# Altium project Power Regulators.PrjPcb
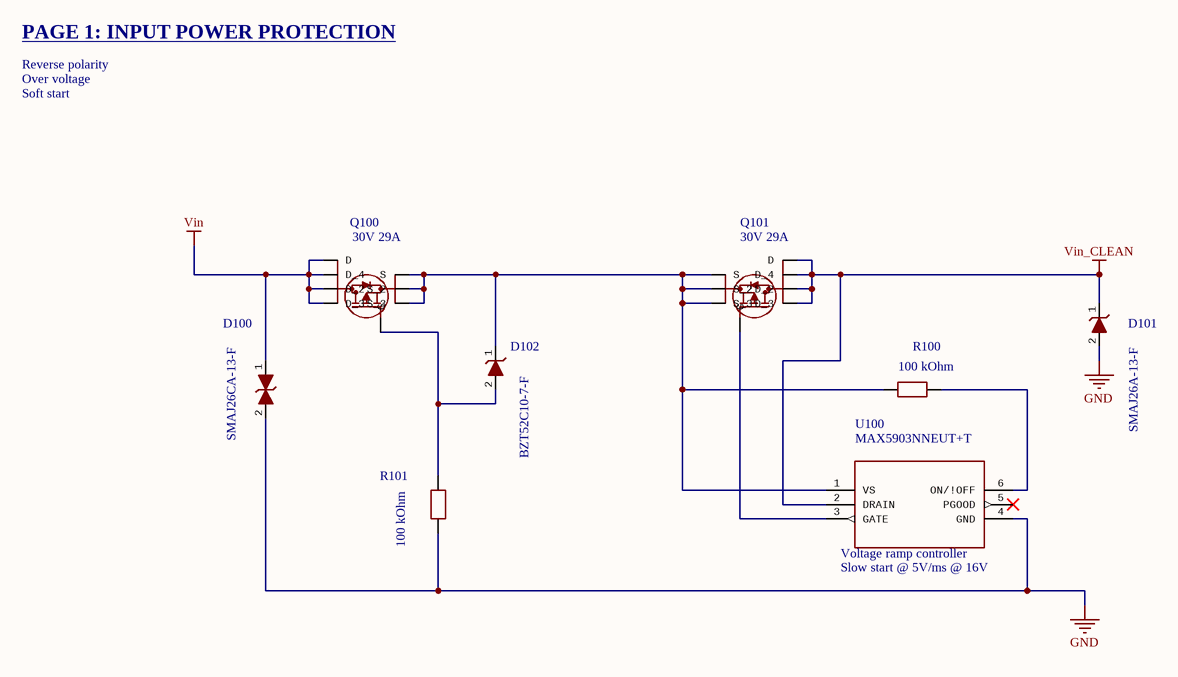
[diagram p0: 1_InputPowerProtection.SchDoc]
7 sheets, 106 parts. Net scope: flat (ports and power ports of the same name join across sheets).
Sheets:
  1_InputPowerProtection.SchDoc
  2_5VSwithcingRegulator.SchDoc
  3_3V3LDO.SchDoc
  4_5VLDO.SchDoc
  5_AnalogSense.SchDoc
  6_Auxilaries.SchDoc
  7_Peripherals.SchDoc

## Sheet 1_InputPowerProtection.SchDoc
size A4; PageSetup: Record=PageOptions|CenterHorizontal=True|CenterVertical=True|PrintScale=1.00|XCorrection=1.00|YCorrection=1.00|PrintKind=1|BorderSize=5000000|LeftOffset=0|BottomOffset=0|Orientation=2|PaperLength=1000|PaperWidth=1000|Scale=100|PaperSource=7|PrintQuality=-3|MediaType=1|DitherType=10|PrintScaleMode=1|PaperKind=Executive|PaperIndex=7

### Parts
D100  SMAJ26CA-13-F  [DIODE_DO-214AC]
D101  SMAJ26A-13-F  [DIODE_DO-214AC]
D102  BZT52C10-7-F  [DIODE_SOD-123]
Q100  value 30V 29A  [MOSFET_SOIC-8]  (hidden comment: SI4459ADY)
Q101  value 30V 29A  [MOSFET_SOIC-8]  (hidden comment: SI4459ADY)
R100  value 100 kOhm  [RES_0603]  (hidden comment: ERJ3GEYJ104V)
R101  value 100 kOhm  [RES_0603]  (hidden comment: ERJ3GEYJ104V)
U100  MAX5903NNEUT+T  [HOTSWAP_SOT-6]

### Nets
GND: D100.2 D101.2 R101.1 U100.4(GND)
Vin: D100.1 Q100.5(D_3) Q100.6(D_2) Q100.7(D_4) Q100.8(D)
Vin_CLEAN: D101.1 Q101.5(D_3) Q101.6(D_2) Q101.7(D_4) Q101.8(D) U100.2(DRAIN)
NetD102_1: D102.1 Q100.1(S_3) Q100.2(S_2) Q100.3(S) Q101.1(S_3) Q101.2(S_2) Q101.3(S) R100.1 U100.1(VS)
NetD102_2: D102.2 Q100.4(G) R101.2
NetQ101_4: Q101.4(G) U100.3(GATE)
NetR100_2: R100.2 U100.6(ON/!OFF)

Not connected (* = marked no-connect by the designer): U100 5(PGOOD)*

### Notes on the sheet
- PAGE 1: INPUT POWER PROTECTION
- Reverse polarity
- Over voltage
- Soft start
- (near U100) Voltage ramp controller
- (near U100) Slow start @ 5V/ms @ 16V

### Library data of the parts
D100 = SMAJ26CA-13-F: Diode TVS Bidirectional 26V; Mfr_Name: Diodes Inc; Manufacturer_Part_Number: SMAJ26A-13-F; Value: 26V; Link: https://www.digikey.ca/en/products/detail/diodes-incorporated/SMAJ26A-13-F/806555?s=N4IgTCBcDaIMoFkCCApMA2JBaAYgEQEkAVAJSwDk8QBdAXyA; Package: DO-214AC; PartNumber: SMAJ26CA-13-F; SupplierPartNumber: SMAJ26CA-FDITR-ND; SuppliersPartNumber: C134976
D101 = SMAJ26A-13-F: Diode TVS 26V; Mfr_Name: Diodes Inc; GateName_1: A; DeviceName: SMA_DIO; SymbolName_1: DIODE; LibraryName: 2022-09-06_21-11-13_Library; DeviceSetName: SMAJ26A-13-F; Copyright: Copyright (C) 2022 Ultra Librarian. All rights reserved.; Manufacturer_Part_Number: SMAJ26A-13-F; Digi-Key_Part_Number_1: SMAJ26A-FDICT-ND; Digi-Key_Part_Number_2: SMAJ26A-FDIDKR-ND; Digi-Key_Part_Number_3: SMAJ26A-FDITR-ND; Link: https://www.digikey.ca/en/products/detail/diodes-incorporated/SMAJ26A-13-F/806555?s=N4IgTCBcDaIMoFkCCApMA2JBaAjAZiwDEQBdAXyA; Package: DO-214AC; PartNumber: SMAJ26A-13-F; SupplierPartNumber: SMAJ26A-FDITR-ND; SuppliersPartNumber: C134975
D102 = BZT52C10-7-F: Diode Zener 10V 370mW; Manufacturer_Name: Diodes Inc.; SymbolName_1: BZT52C10-7-F; LibraryName: BZT52C10-7-F; DeviceSetName: BZT52C10-7-F; Manufacturer_Part_Number: BZT52C10-7-F; Mouser_Part_Number: 621-BZT52C10-F; Mouser_Price-Stock: https://www.mouser.co.uk/ProductDetail/Diodes-Incorporated/BZT52C10-7-F?qs=%2F0USrAtie8G0fxvqWmtHrQ%3D%3D; Link: https://www.digikey.ca/en/products/detail/diodes-incorporated/BZT52C10-7-F/717726; Value: 10V 370mW; Package: SOD-123; PartNumber: BZT52C10-7-F; SupplierPartNumber: BZT52C10-FDITR-ND; SuppliersPartNumber: C155227
Q100 Q101 = SI4459ADY-T1-GE3SO_ADY-T1-GE3_VIS-M: P-Channel 30V 29A 5mOHm; Mfr_Name: Vishay; Manufacturer_Part_Number: SI4459ADY-T1-GE3; Link: https://www.digikey.ca/en/products/detail/vishay-siliconix/SI4459ADY-T1-GE3/1978849?s=N4IgTCBcDaIMoEkAsSCsBOAggEQJoFoAVARnwHEBRAZhAF0BfIA; Package: SOIC-8; PartNumber: SI4459ADY-T1-GE3; SupplierNumber: SI4459ADY-T1-GE3TR-ND; SuppliersPartNumber: C143743
R100 R101 = ERJ3GEYJ104V: Res 100kOhm 1/10W 0603; Manufacturer_Name: Panasonic; Link: https://www.digikey.ca/en/products/detail/panasonic-electronic-components/ERJ-3GEYJ104V/135832?s=N4IgTCBcDaIKICUBSBmA4nAmkgjABgBYA1EAXQF8g; Package: 0603; SupplierPartNumber: P100KGTR-ND; SuppliersPartNumber: C278633; PartNumber: ERJ3GEYJ104V
U100 = MAX5903NNEUT+T: Hot Swap Controller MAX5903NNEUT+T; Manufacturer: Analog Devices Inc; DeviceName: 21-0058_U6F+6_MXM-M; DeviceSetName: MAX5903NNEUT+T; Copyright: Copyright (C) 2023 Ultra Librarian. All rights reserved.; PartNumber: MAX5903NNEUT+T; Digi-Key_Part_Number_1: MAX5903NNEUT+T-ND; Digi-Key_Part_Number_2: MAX5903NNEUT+TCT-ND; Digi-Key_Part_Number_3: MAX5903NNEUT+TDKR-ND; Link: https://www.digikey.ca/en/products/detail/analog-devices-inc-maxim-integrated/MAX5903NNEUT-T/1781318?s=N4IgTCBcDaILIEEAaBWAnABgMwDkcFEBVAFQGpiQBdAXyA; SupplierNumber: MAX5903NNEUT+TTR-ND; SuppliersPartNumber: *; Value: *; Package: SOT-23-6

## Sheet 2_5VSwithcingRegulator.SchDoc
size A4; PageSetup: Record=PageOptions|CenterHorizontal=True|CenterVertical=True|PrintScale=1.00|XCorrection=1.00|YCorrection=1.00|PrintKind=1|BorderSize=5000000|LeftOffset=0|BottomOffset=0|Orientation=2|PaperLength=1000|PaperWidth=1000|Scale=100|PaperSource=7|PrintQuality=-3|MediaType=1|DitherType=10|PrintScaleMode=1|PaperKind=Executive|PaperIndex=7
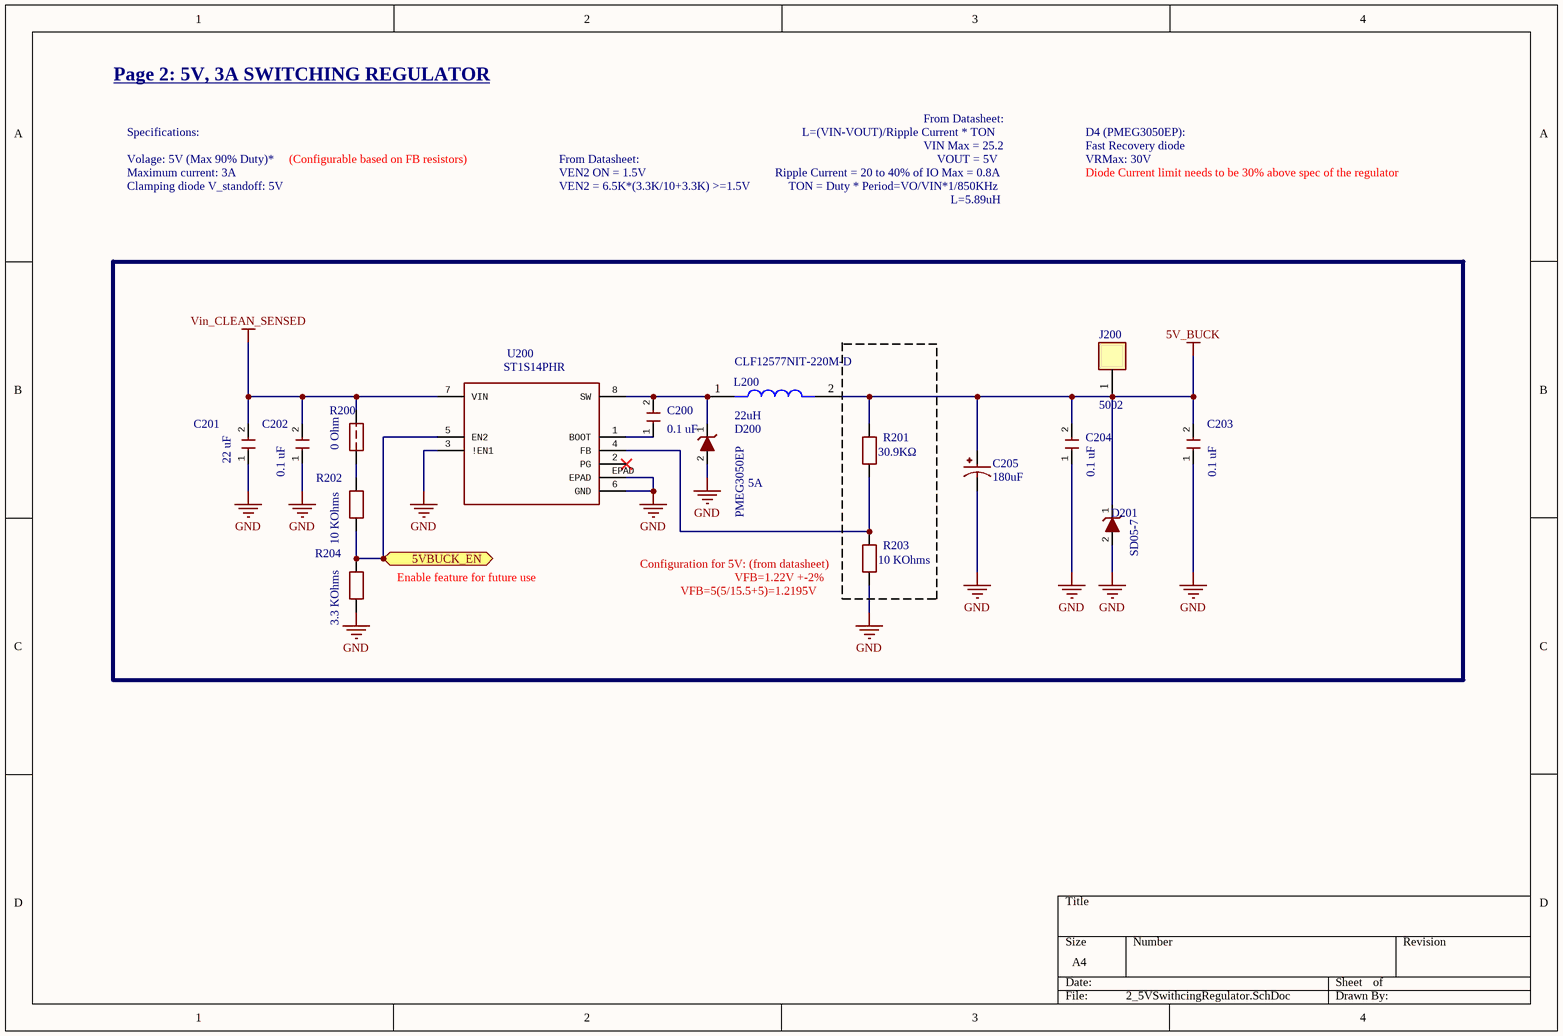
[diagram p1: 2_5VSwithcingRegulator.SchDoc]

### Parts
C200  value 0.1 uF  [CAP_0603]  (hidden comment: CL10B104KB8NNNC)
C201  value 22 uF  [CAP_0603]  (hidden comment: GRM188R61A226ME15D)
C202  value 0.1 uF  [CAP_0603]  (hidden comment: CL10B104KB8NNNC)
C203  value 0.1 uF  [CAP_0603]  (hidden comment: CL10B104KB8NNNC)
C204  value 0.1 uF  [CAP_0603]  (hidden comment: CL10B104KB8NNNC)
C205  value 180uF  [CAP_EEEFKE181XSP]  (hidden comment: EEE-FKE181XSP)
D200  PMEG3050EP  [DIODE_SOD-128]
D201  SD05-7  [DIODE_DO-214AC]
J200  5002  [KEYSTONE_5002]
L200  CLF12577NIT-220M-D  value 22uH  [IND_TDK_CLF12577NIT]
R200  value 0 Ohm  [RES_0603]  (hidden comment: ERJ3GEY0R00V)
R201  value 30.9KΩ  [RES_0603]  (hidden comment: CRCW060330K9FKEA)
R202  value 10 KOhms  [RES_0603]  (hidden comment: ERJ3GEYJ103V)
R203  value 10 KOhms  [RES_0603]  (hidden comment: ERJ3GEYJ103V)
R204  value 3.3 KOhms  [RES_0603]  (hidden comment: P3.3KGDKR-ND)
U200  ST1S14PHR  [REG_SOP8_SOIC8_EPAD]

### Ports
5VBUCK_EN (in)

### Nets
5V_BUCK: C203.2 C204.2 C205.1 D201.1 J200.1 L200.2 R201.2
GND: C201.1 C202.1 C203.1 C204.1 C205.2 D200.2 D201.2 R203.1 R204.1 U200.3(!EN1) U200.6(GND) U200.EPAD
Vin_CLEAN_SENSED: C201.2 C202.2 R200.2 U200.7(VIN)
5VBUCK_EN: R202.1 R204.2 U200.5(EN2) ; port 5VBUCK_EN
NetC200_1: C200.1 U200.1(BOOT)
NetC200_2: C200.2 D200.1 L200.1 U200.8(SW)
NetR200_1: R200.1 R202.2
NetR201_1: R201.1 R203.2 U200.4(FB)

Not connected (* = marked no-connect by the designer): U200 2(PG)*

### Notes on the sheet
- Page 2: 5V, 3A SWITCHING REGULATOR
- Volage: 5V (Max 90% Duty)*
- Maximum current: 3A
- Specifications:
- (Configurable based on FB resistors)
- From Datasheet:
- VEN2 ON = 1.5V
- Ripple Current = 20 to 40% of IO Max = 0.8A
- L=(VIN-VOUT)/Ripple Current * TON
- VIN Max = 25.2
- VOUT = 5V
- Fast Recovery diode
- VRMax: 30V
- D4 (PMEG3050EP):
- Diode Current limit needs to be 30% above spec of the regulator
- Clamping diode V_standoff: 5V
- VEN2 = 6.5K*(3.3K/10+3.3K) >=1.5V
- TON = Duty * Period=VO/VIN*1/850KHz
- L=5.89uH
- (near D200) 5A
- (near R204) Enable feature for future use
- (near R203) Configuration for 5V: (from datasheet)
- (near R203) VFB=1.22V +-2%
- (near R203) VFB=5(5/15.5+5)=1.2195V

### Library data of the parts
C200 C202-C204 = CL10B104KB8NNNC: Cap Ceramic 0.1uF 50V 0603; Manufacturer_Name: Samsung; Link: https://www.digikey.ca/en/products/detail/samsung-electro-mechanics/CL10B104KB8NNNC/3886658?s=N4IgTCBcDaIMIBkCMAGAQqgLAaTQDgDki4QBdAXyA; Package: 0603; PartNumber: CL10B104KB8NNNC; SupplierPartNumber: 1276-1000-2-ND; SuppliersPartNumber: C1591
C201 = GRM188R61A226ME15D: Cap Ceramic 22uF 10V 0603; Manufacturer_Name: Samsung Electro-Mechanics; Link: https://www.digikey.ca/en/products/detail/murata-electronics/GRM188R61A226ME15D/5027561?s=N4IgTCBcDaIOICUCyBGAHGhA2FBBMYWSAoigKwAiIAugL5A; Package: 0603; PartNumber: GRM188R61A226ME15D; SupplierNumber: 490-10476-2-ND; SuppliersPartNumber: C84419
C205 = EEEFKE181XSP: Cap Electrolytic 180uF SMD,D6.3xL7.7mm; Manufacturer: Panasonic; Package: SMD,D6.3xL7.7mm; PartNumber: EEE-FKE181XSP; SupplierNumber: P18956TR-ND; SuppliersPartNumber: C413657; Link: https://www.digikey.ca/en/products/detail/panasonic-electronic-components/EEE-FKE181XSP/5805038?s=N4IgTCBcDaIKIIGIGk4EYAcaAaBlACiALoC%2BQA
D200 = PMEG3050EP: Diode FastRecovery 30V SOD-128; Mfr_Name: Nexperia; Value: FastRecovery 30V; Link: https://www.digikey.ca/en/products/detail/nexperia-usa-inc/PMEG3050EP-115/2228695; Package: SOD-128; PartNumber: PMEG3050EP; SupplierPartNumber: 1727-5317-2-ND; SuppliersPartNumber: C134975
D201 = SD05-7: Diode TVS 5V; Mfr_Name: Diodes Inc; Value: TVS 5V; Link: https://www.digikey.ca/en/products/detail/diodes-incorporated/SD05-7/2052792; Package: SOD-323; PartNumber: SD05-7; SupplierPartNumber: SD05DITR-ND; SuppliersPartNumber: C460454
J200 = 5002: Test Point Ring Keystone; Manufacturer: Keystone Electronics; Value: Test Point Keystone Electronics; Package: *; PartNumber: 5002; SupplierNumber: 36-5002-ND; SuppliersPartNumber: C238123; Link: https://www.digikey.ca/en/products/detail/keystone-electronics/5002/255328
L200 = CLF12577NIT-220M-D: Ind 22uH Shielded Drum Core 4.5A; Manufacturer: TDK; PartNumber: CLF12577NIT-220M-D; Package: NON STANDARD-2 TDK; Link: https://www.digikey.ca/en/products/detail/tdk-corporation/CLF12577NIT-220M-D/6236873?s=N4IgTCBcDaIMIBkBiBGMBWA7JgcgSQBUBaMMABgFkiAREAXQF8g; SupplierPartNumber: 445-174735-2-ND; SuppliersPartNumber: C138319
R200 = ERJ3GEY0R00V: Res 0Ohm 1/10W 0603; Link: https://www.digikey.ca/en/products/detail/panasonic-electronic-components/ERJ-3GEY0R00V/135656?s=N4IgTCBcDaIKICUBSBmA4nAmgBgd7AaiALoC%2BQA; Package: 0603; SupplierPartNumber: P0.0GTR-ND; SuppliersPartNumber: C122704; PartNumber: ERJ3GEY0R00V
R201 = CRCW060330K9FKEA: Res 30.9KOhm 1/10W 0603; Manufacturer_Name: Vishay Intertech; Link: https://www.digikey.ca/en/products/detail/vishay-dale/CRCW060330K9FKEAHP/2222269; Package: 0603; SupplierPartNumber: 541-30.9KSTR-ND; SuppliersPartNumber: C844354; PartNumber: CRCW060330K9FKEA
R202 R203 = ERJ3GEYJ103V: Res 10KOhms 1/10W 0603; Link: https://www.mouser.ca/ProductDetail/Panasonic/ERJ-3GEYJ103V?qs=66DK8nO8gJBWgc%252B0VNNxzg%3D%3D; Package: 0603; PartNumber: ERJ3GEYJ103V; SupplierPartNumber: 667-ERJ-3GEYJ103V; SuppliersPartNumber: C169849
R204 = P3.3KGDKR-ND: Res 3.3KOhms 1/10W 0603; PartNumber: ERJ-3GEYJ332V; SymbolName_1: RES; Link: https://www.digikey.ca/en/products/detail/panasonic-electronic-components/ERJ-3GEYJ332V/135886?s=N4IgTCBcDaIKICUBSBaAzAcTgTSWtYAaiALoC%2BQA; Package: 0603; SupplierNumber: P3.3KGDKR-ND; SuppliersPartNumber: C403480
U200 = ST1S14PHR: Switching Step-down In5.5V~48V Out3A; Mfr_Name: STMicroelectronics; DeviceSetName: ST1S14PHR; Manufacturer_Part_Number: ST1S14PHR; Value: Switching Step-down; Link: https://www.digikey.ca/en/products/detail/stmicroelectronics/ST1S14PHR/2469146?s=N4IgTCBcDaIMoBUCMckBYAKAJASiAugL5A; Package: HSOP-8; PartNumber: ST1S14PHR; SupplierPartNumber: 497-10816-2-ND; SuppliersPartNumber: C84130

## Sheet 3_3V3LDO.SchDoc
size A4; PageSetup: Record=PageOptions|CenterHorizontal=True|CenterVertical=True|PrintScale=1.00|XCorrection=1.00|YCorrection=1.00|PrintKind=1|BorderSize=5000000|LeftOffset=0|BottomOffset=0|Orientation=2|PaperLength=1000|PaperWidth=1000|Scale=100|PaperSource=7|PrintQuality=-3|MediaType=1|DitherType=10|PrintScaleMode=1|PaperKind=Executive|PaperIndex=7
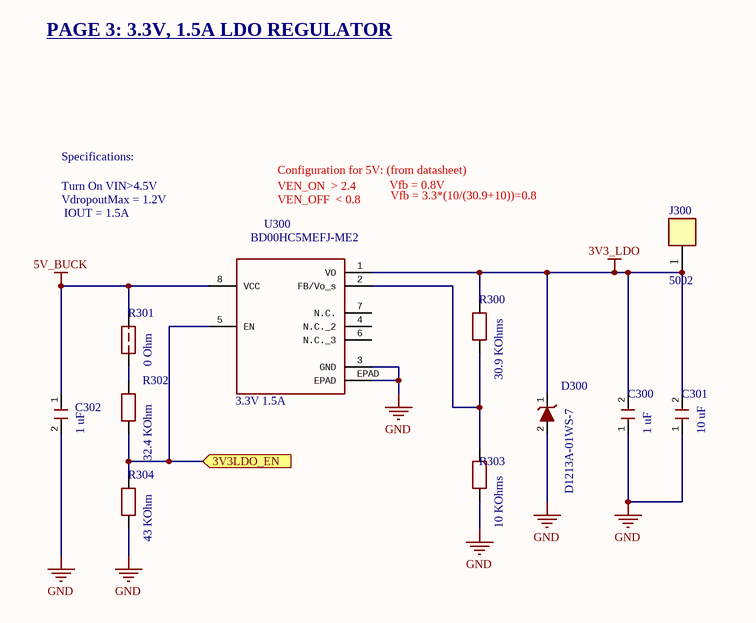
[diagram p2: 3_3V3LDO.SchDoc]

### Parts
C300  value 1 uF  [CAP_0603]  (hidden comment: GCM188R71C105KA64)
C301  value 10 uF  [CAP_0603]  (hidden comment: GRM188R61E106KA73D)
C302  value 1 uF  [CAP_0603]  (hidden comment: GRT188R61H105KE13D)
D300  D1213A-01WS-7  [DIODE_DO-214AC]
J300  5002  [KEYSTONE_5002]
R300  value 30.9 KOhms  [RES_0603]  (hidden comment: ERJ6ENF3092V)
R301  value 0 Ohm  [RES_0603]  (hidden comment: ERJ3GEY0R00V)
R302  value 32.4 KOhm  [RES_0603]  (hidden comment: RC0603FR-0732K4L)
R303  value 10 KOhms  [RES_0603]  (hidden comment: ERJ3GEYJ103V)
R304  value 43 KOhm  [RES_0603]  (hidden comment: ERJ3GEYJ433V)
U300  BD00HC5MEFJ-ME2  value 3.3V 1.5A  [REG_SOP8_SOIC8_EPAD]

### Ports
3V3LDO_EN (in)

### Nets
3V3_LDO: C300.2 C301.2 D300.1 J300.1 R300.2 U300.1(VO)
5V_BUCK: C302.1 R301.2 U300.8(VCC)
GND: C300.1 C301.1 C302.2 D300.2 R303.1 R304.1 U300.3(GND) U300.EPAD
3V3LDO_EN: R302.2 R304.2 U300.5(EN) ; port 3V3LDO_EN
NetR300_1: R300.1 R303.2 U300.2(FB/Vo_s)
NetR301_1: R301.1 R302.1

Not connected (* = marked no-connect by the designer): U300 4(N.C._2) 6(N.C._3) 7(N.C.)

### Notes on the sheet
- PAGE 3: 3.3V, 1.5A LDO REGULATOR
- Turn On VIN>4.5V
- Specifications:
- VEN_ON  > 2.4
- Configuration for 5V: (from datasheet)
- Vfb = 0.8V
- VdropoutMax = 1.2V
- IOUT = 1.5A
- VEN_OFF  < 0.8
- Vfb = 3.3*(10/(30.9+10))=0.8

### Library data of the parts
C300 = GCM188R71C105KA64D: Cap Ceramic 1uF 16V 0603; Manufacturer_Name: Murata Electronics; GateName_1: G$1; SymbolName_1: GCM188R71C105KA64D; LibraryName: GCM188R71C105KA64D; DeviceSetName: GCM188R71C105KA64D; Manufacturer_Part_Number: GCM188R71C105KA64D; Mouser_Part_Number: 81-GCM188R71C105K64D; Mouser_Price-Stock: https://www.mouser.co.uk/ProductDetail/Murata-Electronics/GCM188R71C105KA64D?qs=bQrJpfqjX%252BKtVgLYIBGvIg%3D%3D; Arrow_Part_Number: GCM188R71C105KA64D; Arrow_Price-Stock: https://www.arrow.com/en/products/gcm188r71c105ka64d/murata-manufacturing?region=nac; Height: 0.9mm; Link: https://www.digikey.ca/en/products/detail/murata-electronics/GCM188R71C105KA64D/1979250; Package: 0603; PartNumber: GCM188R71C105KA64; SupplierPartNumber: 490-5241-2-ND; SuppliersPartNumber: C161212
C301 = GRM188R61E106KA73D: Cap Ceramic 10uF 35V 0603; Manufacturer_Name: Murata Electronics; Link: https://www.digikey.ca/en/products/detail/murata-electronics/GRM188R61E106KA73D/9867922?s=N4IgTCBcDaIOICUCyBGAHGhA2FBRFADFgNICCA7AMwAiIAugL5A; Package: 0603; PartNumber: GRM188R61E106KA73D; SupplierPartNumber: 490-18214-2-ND; SuppliersPartNumber: C344022
C302 = GRT188R61H105KE13D: Cap Ceramic 1uF 50V 0603; Manufacturer: Murata Electronics; PartNumber: GCM188R71C105KA64; Link: https://www.digikey.ca/en/products/detail/murata-electronics/GRT188R61H105KE13D/5416752?s=N4IgTCBcDaIOICUAqBGAHGhA2FAJFADAKwDSAoigMwAiIAugL5A; Package: 0603; SupplierPartNumber: 490-12330-2-ND; SuppliersPartNumber: C126631
D300 = D1213A-01WS-7: Diode TVS 3V3; Manufacturer: Diodes Inc; Value: TVS 3V3; Link: https://www.digikey.ca/en/products/detail/diodes-incorporated/D1213A-01WS-7/3340446?s=N4IgTCBcDaICIEYwIMwEEC0AGBB1AyhgOwgC6AvkA; Package: SOD-323; PartNumber: D1213A-01WS-7; SupplierPartNumber: D1213A-01WS-7DITR-ND; SuppliersPartNumber: C170167
J300 = 5002: as J200 on sheet 2_5VSwithcingRegulator; Package: *; PartNumber: 5002; SupplierNumber: 36-5002-ND; SuppliersPartNumber: C238123; Link: https://www.digikey.ca/en/products/detail/keystone-electronics/5002/255328
R300 = ERJ6ENF3092V: Res 30.9KOhms 1/8W 0603; Link: https://www.digikey.ca/en/products/detail/panasonic-electronic-components/ERJ-6ENF3092V/111570?s=N4IgTCBcDaIKICUBSA2OA5AYgZgAwE4wA1EAXQF8g; Package: 0603; PartNumber: ERJ6ENF3092V; SupplierPartNumber: P30.9KCTR-ND; SuppliersPartNumber: C416839
R301 = ERJ3GEY0R00V: Res 0Ohm 1/10W 0603; Link: https://www.digikey.ca/en/products/detail/panasonic-electronic-components/ERJ-3GEY0R00V/135656?s=N4IgTCBcDaIKICUBSBmA4nAmgBgd7AaiALoC%2BQA; Package: 0603; SupplierPartNumber: P0.0GTR-ND; SuppliersPartNumber: C122704; PartNumber: ERJ3GEY0R00V
R302 = RC0603FR-0732K4L: Res 32.4KOhm 1/10W 0603; Link: https://www.digikey.ca/en/products/detail/RC0603FR-0732K4L/311-32.4KHRCT-ND/730102?curr=cad&utm_campaign=buynow&utm_medium=aggregator&utm_source=octopart; Package: 0603; PartNumber: RC0603FR-0732K4L; SupplierPartNumber: 311-32.4KHRCT-ND; SuppliersPartNumber: C309561
R303 = ERJ3GEYJ103V: Res 10KOhms 1/10W 0603; Link: https://www.mouser.ca/ProductDetail/Panasonic/ERJ-3GEYJ103V?qs=66DK8nO8gJBWgc%252B0VNNxzg%3D%3D; Package: 0603; PartNumber: ERJ3GEYJ103V; SupplierPartNumber: 667-ERJ-3GEYJ103V; SuppliersPartNumber: C169849
R304 = ERJ3GEYJ433V: Res 43KOhm 1/10W 0603; Manufacturer_Name: Panasonic; Height: 0.55mm; Link: https://www.digikey.ca/en/products/detail/panasonic-electronic-components/ERJ-3GEYJ433V/104624; Package: 0603; PartNumber: ERJ3GEYJ433V; SupplierPartNumber: P43KGTR-ND; SuppliersPartNumber: C403499
U300 = BD00HC5MEFJ-ME2: LDO 5Vin 3V3Out 1.5A; Manufacturer: ROHM Semiconductor; PartNumber: BD00HC5MEFJ-ME2; SupplierNumber: BD00HC5MEFJ-ME2TR-ND; Link: https://www.digikey.ca/en/products/detail/rohm-semiconductor/BD00HC5MEFJ-ME2/4625492?s=N4IgTCBcDaIEYBMAMSAWBjArAWwKYDMArAWjwgF0BfIA; Package: 8-SOIC; SuppliersPartNumber: *

## Sheet 4_5VLDO.SchDoc
size A4
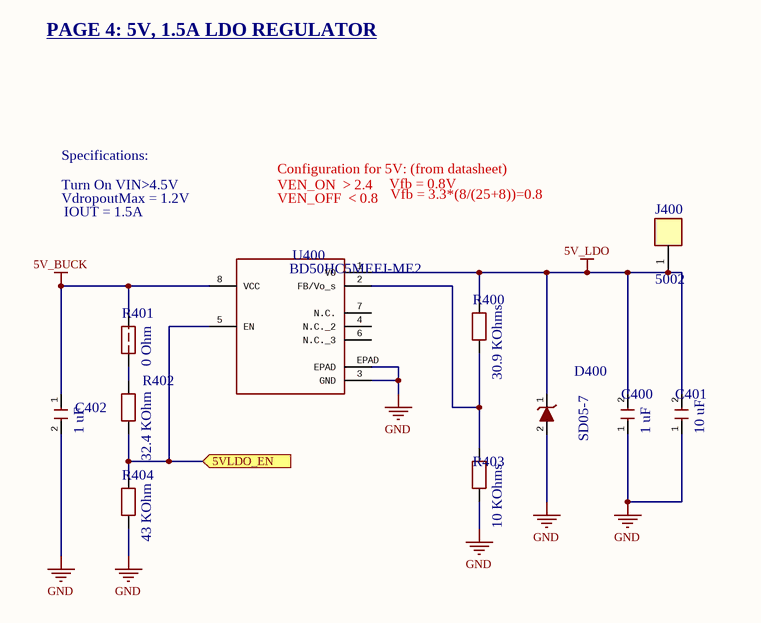
[diagram p3: 4_5VLDO.SchDoc]

### Parts
C400  value 1 uF  [CAP_0603]  (hidden comment: GCM188R71C105KA64)
C401  value 10 uF  [CAP_0603]  (hidden comment: GRM188R61E106KA73D)
C402  value 1 uF  [CAP_0603]  (hidden comment: GRT188R61H105KE13D)
D400  SD05-7  [DIODE_DO-214AC]
J400  5002  [KEYSTONE_5002]
R400  value 30.9 KOhms  [RES_0603]  (hidden comment: ERJ6ENF3092V)
R401  value 0 Ohm  [RES_0603]  (hidden comment: ERJ3GEY0R00V)
R402  value 32.4 KOhm  [RES_0603]  (hidden comment: RC0603FR-0732K4L)
R403  value 10 KOhms  [RES_0603]  (hidden comment: ERJ3GEYJ103V)
R404  value 43 KOhm  [RES_0603]  (hidden comment: ERJ3GEYJ433V)
U400  BD50HC5MEFJ-ME2  [REG_SOP8_SOIC8_EPAD]

### Ports
5VLDO_EN (in)

### Nets
5V_BUCK: C402.1 R401.2 U400.8(VCC)
5V_LDO: C400.2 C401.2 D400.1 J400.1 R400.2 U400.1(VO)
GND: C400.1 C401.1 C402.2 D400.2 R403.1 R404.1 U400.3(GND) U400.EPAD
5VLDO_EN: R402.2 R404.2 U400.5(EN) ; port 5VLDO_EN
NetR400_1: R400.1 R403.2 U400.2(FB/Vo_s)
NetR401_1: R401.1 R402.1

Not connected (* = marked no-connect by the designer): U400 4(N.C._2) 6(N.C._3) 7(N.C.)

### Notes on the sheet
- PAGE 4: 5V, 1.5A LDO REGULATOR
- Specifications:
- Configuration for 5V: (from datasheet)
- Turn On VIN>4.5V
- VdropoutMax = 1.2V
- IOUT = 1.5A
- VEN_ON  > 2.4
- VEN_OFF  < 0.8
- Vfb = 0.8V
- Vfb = 3.3*(8/(25+8))=0.8

### Library data of the parts
C400 = GCM188R71C105KA64D: as C300 on sheet 3_3V3LDO; SymbolName_1: GCM188R71C105KA64D; LibraryName: GCM188R71C105KA64D; DeviceSetName: GCM188R71C105KA64D; Manufacturer_Part_Number: GCM188R71C105KA64D; Mouser_Part_Number: 81-GCM188R71C105K64D; Mouser_Price-Stock: https://www.mouser.co.uk/ProductDetail/Murata-Electronics/GCM188R71C105KA64D?qs=bQrJpfqjX%252BKtVgLYIBGvIg%3D%3D; Arrow_Part_Number: GCM188R71C105KA64D; Arrow_Price-Stock: https://www.arrow.com/en/products/gcm188r71c105ka64d/murata-manufacturing?region=nac; Height: 0.9mm; Link: https://www.digikey.ca/en/products/detail/murata-electronics/GCM188R71C105KA64D/1979250; Package: 0603; PartNumber: GCM188R71C105KA64; SupplierPartNumber: 490-5241-2-ND; SuppliersPartNumber: C161212
C401 = GRM188R61E106KA73D: as C301 on sheet 3_3V3LDO; Link: https://www.digikey.ca/en/products/detail/murata-electronics/GRM188R61E106KA73D/9867922?s=N4IgTCBcDaIOICUCyBGAHGhA2FBRFADFgNICCA7AMwAiIAugL5A; Package: 0603; PartNumber: GRM188R61E106KA73D; SupplierPartNumber: 490-18214-2-ND; SuppliersPartNumber: C344022
C402 = GRT188R61H105KE13D: as C302 on sheet 3_3V3LDO; Link: https://www.digikey.ca/en/products/detail/murata-electronics/GRT188R61H105KE13D/5416752?s=N4IgTCBcDaIOICUAqBGAHGhA2FAJFADAKwDSAoigMwAiIAugL5A; Package: 0603; SupplierPartNumber: 490-12330-2-ND; SuppliersPartNumber: C126631
D400 = SD05-7: as D201 on sheet 2_5VSwithcingRegulator; Link: https://www.digikey.ca/en/products/detail/diodes-incorporated/SD05-7/2052792; Package: SOD-323; PartNumber: SD05-7; SupplierPartNumber: SD05DITR-ND; SuppliersPartNumber: C460454
J400 = 5002: as J200 on sheet 2_5VSwithcingRegulator; Package: *; PartNumber: 5002; SupplierNumber: 36-5002-ND; SuppliersPartNumber: C238123; Link: https://www.digikey.ca/en/products/detail/keystone-electronics/5002/255328
R400 = ERJ6ENF3092V: Res 30.9KOhms 1/8W 0603; Link: https://www.digikey.ca/en/products/detail/panasonic-electronic-components/ERJ-6ENF3092V/111570?s=N4IgTCBcDaIKICUBSA2OA5AYgZgAwE4wA1EAXQF8g; Package: 0603; PartNumber: ERJ6ENF3092V; SupplierPartNumber: P30.9KCTR-ND; SuppliersPartNumber: C416839
R401 = ERJ3GEY0R00V: Res 0Ohm 1/10W 0603; Link: https://www.digikey.ca/en/products/detail/panasonic-electronic-components/ERJ-3GEY0R00V/135656?s=N4IgTCBcDaIKICUBSBmA4nAmgBgd7AaiALoC%2BQA; Package: 0603; SupplierPartNumber: P0.0GTR-ND; SuppliersPartNumber: C122704; PartNumber: ERJ3GEY0R00V
R402 = RC0603FR-0732K4L: Res 32.4KOhm 1/10W 0603; Link: https://www.digikey.ca/en/products/detail/RC0603FR-0732K4L/311-32.4KHRCT-ND/730102?curr=cad&utm_campaign=buynow&utm_medium=aggregator&utm_source=octopart; Package: 0603; PartNumber: RC0603FR-0732K4L; SupplierPartNumber: 311-32.4KHRCT-ND; SuppliersPartNumber: C309561
R403 = ERJ3GEYJ103V: Res 10KOhms 1/10W 0603; Link: https://www.mouser.ca/ProductDetail/Panasonic/ERJ-3GEYJ103V?qs=66DK8nO8gJBWgc%252B0VNNxzg%3D%3D; Package: 0603; PartNumber: ERJ3GEYJ103V; SupplierPartNumber: 667-ERJ-3GEYJ103V; SuppliersPartNumber: C169849
R404 = ERJ3GEYJ433V: as R304 on sheet 3_3V3LDO; Height: 0.55mm; Link: https://www.digikey.ca/en/products/detail/panasonic-electronic-components/ERJ-3GEYJ433V/104624; Package: 0603; PartNumber: ERJ3GEYJ433V; SupplierPartNumber: P43KGTR-ND; SuppliersPartNumber: C403499
U400 = BD50HC5MEFJ-ME2: LDO 8Vin 5Vout 1.5A; Manufacturer: ROHM Semiconductor; Value: LDO 5V; PartNumber: BD50HC5MEFJ-ME2; SupplierNumber: BD50HC5MEFJ-ME2TR-ND; SuppliersPartNumber: *; Package: 8-SOIC

## Sheet 5_AnalogSense.SchDoc
size A4
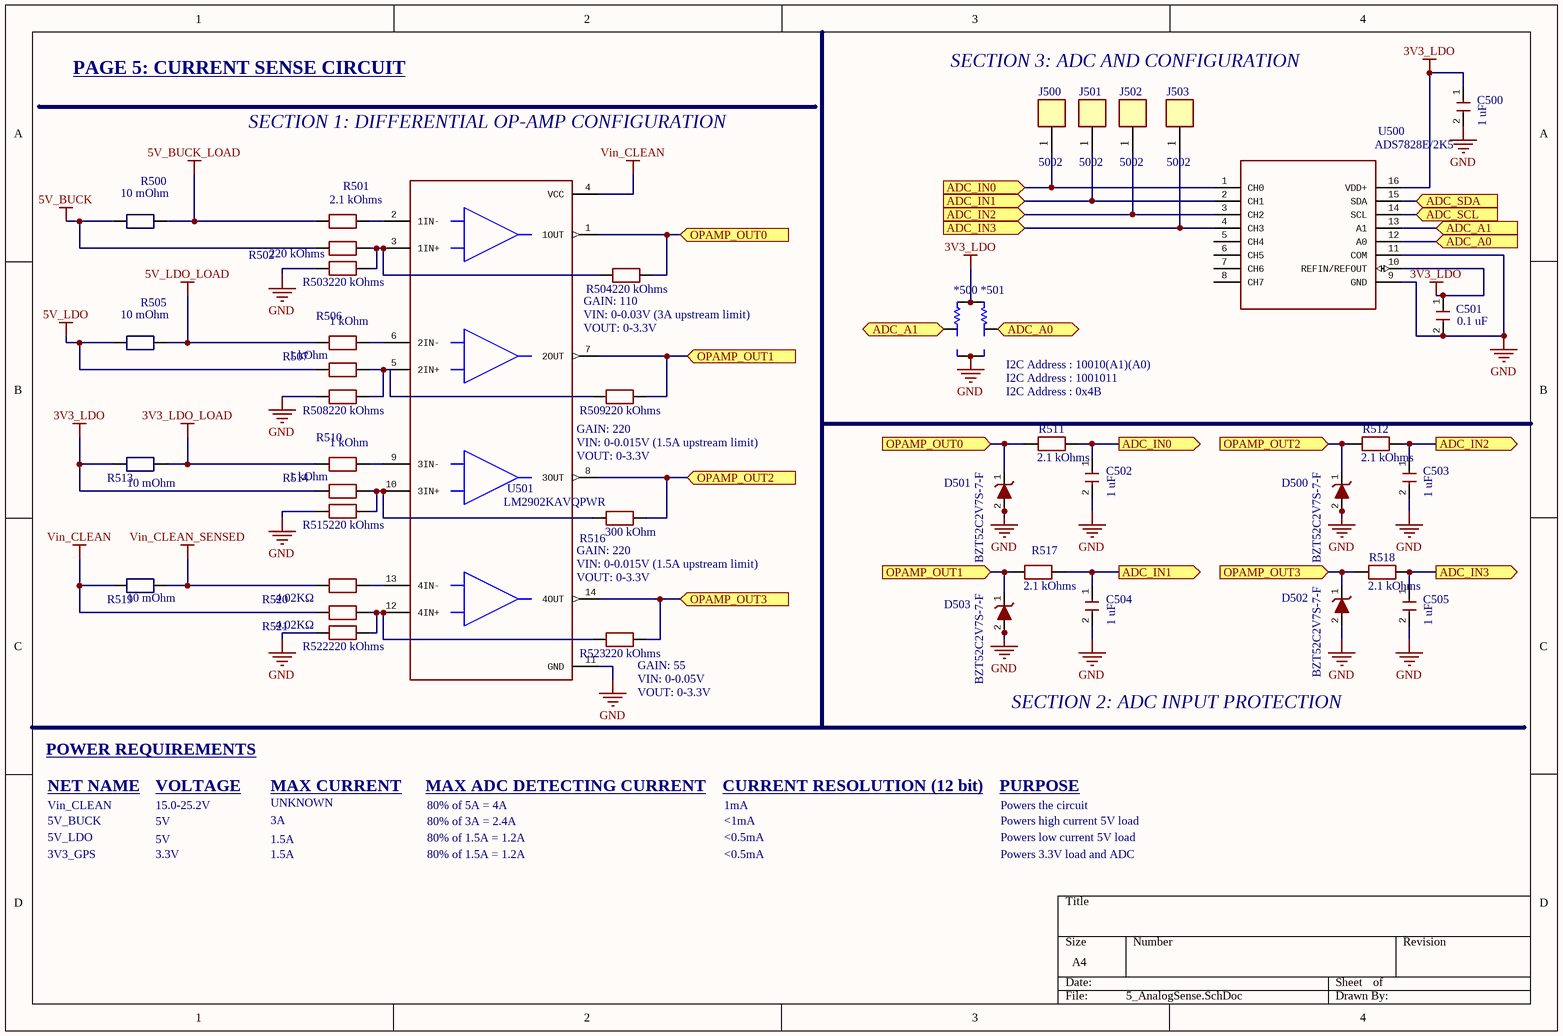
[diagram p4: 5_AnalogSense.SchDoc]

### Parts
*500  3-pin selection 0603  [3-PIN SELECTION CIRCUIT]  (value not drawn)
*501  3-pin selection 0603  [3-PIN SELECTION CIRCUIT]  (value not drawn)
C500  value 1 uF  [CAP_0603]  (hidden comment: GRT188R61H105KE13D)
C501  value 0.1 uF  [CAP_0603]  (hidden comment: CL10B104KB8NNNC)
C502  value 1 uF  [CAP_0603]  (hidden comment: GRT188R61H105KE13D)
C503  value 1 uF  [CAP_0603]  (hidden comment: GRT188R61H105KE13D)
C504  value 1 uF  [CAP_0603]  (hidden comment: GRT188R61H105KE13D)
C505  value 1 uF  [CAP_0603]  (hidden comment: GRT188R61H105KE13D)
D500  BZT52C2V7S-7-F  [DIODE_DO-214AC]
D501  BZT52C2V7S-7-F  [DIODE_DO-214AC]
D502  BZT52C2V7S-7-F  [DIODE_DO-214AC]
D503  BZT52C2V7S-7-F  [DIODE_DO-214AC]
J500  5002  [KEYSTONE_5002]
J501  5002  [KEYSTONE_5002]
J502  5002  [KEYSTONE_5002]
J503  5002  [KEYSTONE_5002]
R500  value 10 mOhm  [RES_0805]  (hidden comment: ERJ6CWFR010V)
R501  value 2.1 kOhms  [RES_0603]  (hidden comment: ERJ-3EKF2101V)
R502  value 220 kOhms  [RES_0603]  (hidden comment: ERJ3EKF2203V)
R503  value 220 kOhms  [RES_0603]  (hidden comment: ERJ3EKF2203V)
R504  value 220 kOhms  [RES_0603]  (hidden comment: ERJ3EKF2203V)
R505  value 10 mOhm  [RES_0805]  (hidden comment: ERJ6CWFR010V)
R506  value 1 kOhm  [RES_0603]  (hidden comment: ERJ3GEYJ102V)
R507  value 1 kOhm  [RES_0603]  (hidden comment: ERJ3GEYJ102V)
R508  value 220 kOhms  [RES_0603]  (hidden comment: ERJ3EKF2203V)
R509  value 220 kOhms  [RES_0603]  (hidden comment: ERJ3EKF2203V)
R510  value 1 kOhm  [RES_0603]  (hidden comment: ERJ3GEYJ102V)
R511  value 2.1 kOhms  [RES_0603]  (hidden comment: ERJ-3EKF2101V)
R512  value 2.1 kOhms  [RES_0603]  (hidden comment: ERJ-3EKF2101V)
R513  value 10 mOhm  [RES_0805]  (hidden comment: ERJ6CWFR010V)
R514  value 1 kOhm  [RES_0603]  (hidden comment: ERJ3GEYJ102V)
R515  value 220 kOhms  [RES_0603]  (hidden comment: ERJ3EKF2203V)
R516  value 300 kOhm  [RES_0603]  (hidden comment: ERJ3GEYJ304V)
R517  value 2.1 kOhms  [RES_0603]  (hidden comment: ERJ-3EKF2101V)
R518  value 2.1 kOhms  [RES_0603]  (hidden comment: ERJ-3EKF2101V)
R519  value 10 mOhm  [RES_0805]  (hidden comment: ERJ6CWFR010V)
R520  value 4.02KΩ  [RES_0603]  (hidden comment: ERA3AEB4021V)
R521  value 4.02KΩ  [RES_0603]  (hidden comment: ERA3AEB4021V)
R522  value 220 kOhms  [RES_0603]  (hidden comment: ERJ3EKF2203V)
R523  value 220 kOhms  [RES_0603]  (hidden comment: ERJ3EKF2203V)
U500  ADS7828E/2K5  [ADC-TSSOP-16]
U501  LM2902KAVQPWR  [OPAMP_TSSOP-14]

### Ports
ADC_A0 (in), ADC_A1 (in), ADC_IN0 (in), ADC_IN0 (out), ADC_IN1 (in), ADC_IN1 (out), ADC_IN2 (in), ADC_IN2 (out), ADC_IN3 (in), ADC_IN3 (out), ADC_SCL (in), ADC_SDA (in), OPAMP_OUT0 (in), OPAMP_OUT1 (in), OPAMP_OUT2 (in), OPAMP_OUT3 (in)

### Nets
3V3_LDO: *500.3 *501.3 C500.1 C501.1 R513.1 R514.1 U500.10(REFIN/REFOUT) U500.16(VDD+)
3V3_LDO_LOAD: R510.1 R513.2
5V_BUCK: R500.1 R502.1
5V_BUCK_LOAD: R500.2 R501.1
5V_LDO: R505.1 R507.1
5V_LDO_LOAD: R505.2 R506.1
GND: *500.1 *501.1 C500.2 C501.2 C502.2 C503.2 C504.2 C505.2 D500.2 D501.2 D502.2 D503.2 R503.1 R508.1 R515.1 R522.1 U500.9(GND) U500.11(COM) U501.11(GND)
Vin_CLEAN: R519.1 R521.1 U501.4(VCC)
Vin_CLEAN_SENSED: R519.2 R520.1
ADC_A0: *501.2 U500.12(A0) ; port ADC_A0
ADC_A1: *500.2 U500.13(A1) ; port ADC_A1
ADC_IN0: C502.1 J500.1 R511.2 U500.1(CH0) ; port ADC_IN0
ADC_IN1: C504.1 J501.1 R517.2 U500.2(CH1) ; port ADC_IN1
ADC_IN2: C503.1 J502.1 R512.2 U500.3(CH2) ; port ADC_IN2
ADC_IN3: C505.1 J503.1 R518.2 U500.4(CH3) ; port ADC_IN3
ADC_SCL: U500.14(SCL) ; port ADC_SCL
ADC_SDA: U500.15(SDA) ; port ADC_SDA
OPAMP_OUT0: D501.1 R504.2 R511.1 U501.1(1OUT) ; port OPAMP_OUT0
OPAMP_OUT1: D503.1 R509.2 R517.1 U501.7(2OUT) ; port OPAMP_OUT1
OPAMP_OUT2: D500.1 R512.1 R516.2 U501.8(3OUT) ; port OPAMP_OUT2
OPAMP_OUT3: D502.1 R518.1 R523.2 U501.14(4OUT) ; port OPAMP_OUT3
NetR501_2: R501.2 U501.2(1IN-)
NetR502_2: R502.2 R503.2 R504.1 U501.3(1IN+)
NetR506_2: R506.2 U501.6(2IN-)
NetR507_2: R507.2 R508.2 R509.1 U501.5(2IN+)
NetR510_2: R510.2 U501.9(3IN-)
NetR514_2: R514.2 R515.2 R516.1 U501.10(3IN+)
NetR520_2: R520.2 U501.13(4IN-)
NetR521_2: R521.2 R522.2 R523.1 U501.12(4IN+)

Not connected (* = marked no-connect by the designer): U500 5(CH4) 6(CH5) 7(CH6) 8(CH7)

### Notes on the sheet
- PAGE 5: CURRENT SENSE CIRCUIT
- SECTION 3: ADC AND CONFIGURATION
- SECTION 1: DIFFERENTIAL OP-AMP CONFIGURATION
- GAIN: 110
- (near U501) VIN: 0-0.03V (3A upstream limit)
- (near U501) VOUT: 0-3.3V
- (near *501) I2C Address : 10010(A1)(A0)
- (near *501) I2C Address : 1001011
- (near U501) GAIN: 220
- (near U501) VIN: 0-0.015V (1.5A upstream limit)
- I2C Address : 0x4B
- (near R523) GAIN: 55
- (near R523) VIN: 0-0.05V
- VOUT: 0-3.3V
- SECTION 2: ADC INPUT PROTECTION
- POWER REQUIREMENTS
- NET NAME
- Vin_CLEAN
- 5V_BUCK
- 5V_LDO
- VOLTAGE
- 15.0-25.2V
- 5V
- MAX CURRENT
- UNKNOWN
- 3A
- 1.5A
- MAX ADC DETECTING CURRENT
- 80% of 5A = 4A
- 80% of 3A = 2.4A
- 80% of 1.5A = 1.2A
- CURRENT RESOLUTION (12 bit)
- 1mA
- <1mA
- <0.5mA
- PURPOSE
- Powers the circuit
- Powers high current 5V load
- Powers low current 5V load
- 3V3_GPS
- 3.3V
- Powers 3.3V load and ADC

### Library data of the parts
C500 C502-C505 = GRT188R61H105KE13D: as C302 on sheet 3_3V3LDO; Link: https://www.digikey.ca/en/products/detail/murata-electronics/GRT188R61H105KE13D/5416752?s=N4IgTCBcDaIOICUAqBGAHGhA2FAJFADAKwDSAoigMwAiIAugL5A; Package: 0603; SupplierPartNumber: 490-12330-2-ND; SuppliersPartNumber: C126631
C501 = CL10B104KB8NNNC: as C200 on sheet 2_5VSwithcingRegulator; Link: https://www.digikey.ca/en/products/detail/samsung-electro-mechanics/CL10B104KB8NNNC/3886658?s=N4IgTCBcDaIMIBkCMAGAQqgLAaTQDgDki4QBdAXyA; Package: 0603; PartNumber: CL10B104KB8NNNC; SupplierPartNumber: 1276-1000-2-ND; SuppliersPartNumber: C1591
D500-D503 = BZT52C2V7S-7-F: Diode Zener 2V7; Manufacturer: Diodes Inc; Value: TVS 2V7; Link: https://www.digikey.ca/en/products/detail/diodes-incorporated/BZT52C2V7S-7-F/739746; Package: SOD-323; PartNumber: BZT52C2V7S-7-F; SupplierPartNumber: BZT52C2V7S-FDITR-ND; SuppliersPartNumber: C260926
J500-J503 = 5002: as J200 on sheet 2_5VSwithcingRegulator; Package: *; PartNumber: 5002; SupplierNumber: 36-5002-ND; SuppliersPartNumber: C238123; Link: https://www.digikey.ca/en/products/detail/keystone-electronics/5002/255328
R500 R505 R513 R519 = ERJ6CWFR010V: Res 10mOhm 1/2W Sense Resistor 0805; Link: https://www.digikey.ca/en/products/detail/panasonic-electronic-components/ERJ-6CWFR010V/6004279?s=N4IgTCBcDaIKICUBSA2AwgdQGIIAwEZcA1EAXQF8g; Package: 0805; PartNumber: ERJ6CWFR010V; SupplierPartNumber: P19196CT-ND; SuppliersPartNumber: C236283
R501 = ERJ-3EKF2101VRC0603N_PAN-M: Res 2.1KOhms 1/10W 0603; Link: https://www.digikey.ca/en/products/detail/panasonic-electronic-components/ERJ-3EKF2101V/196185; Package: 0603; PartNumber: ERJ-3EKF2101V; SupplierNumber: P2.10KHDKR-ND; SuppliersPartNumber: C403065
R502-R504 R508 R509 R515 R522 R523 = ERJ3EKF2203V: Res 220kOhms 1/10W 0603; Link: https://www.digikey.ca/en/products/detail/panasonic-electronic-components/ERJ-3EKF2203V/1746338?s=N4IgTCBcDaIKICUBSBmOBpAYmMAGFAaiALoC%2BQA; Package: 0603; PartNumber: ERJ3EKF2203V; SupplierPartNumber: P220KHTR-ND; SuppliersPartNumber: C403074
R506 R507 R510 R514 = ERJ3GEYJ102V: Res 1kOhm 1/10W 0603; Manufacturer_Name: Panasonic; SymbolName_1: ERJ3GEYJ102V; Link: https://www.digikey.ca/en/products/detail/panasonic-electronic-components/ERJ-3GEYJ102V/68472?s=N4IgTCBcDaIKICUBSBmA4nAmkgjABjADUQBdAXyA; Package: 0603; PartNumber: ERJ3GEYJ102V; SupplierPartNumber: P1.0KGCT-ND; SuppliersPartNumber: C180848
R511 R512 R517 R518 = ERJ-3EKF2101V: Res 2.1KOhms 1/10W 0603; Link: https://www.digikey.ca/en/products/detail/panasonic-electronic-components/ERJ-3EKF2101V/196185; Package: 0603; PartNumber: ERJ-3EKF2101V; SupplierNumber: P2.10KHDKR-ND; SuppliersPartNumber: C403065
R516 = ERJ3GEYJ304V: Res 300kOhm 1/10W 0603; Manufacturer_Name: Panasonic; Link: https://www.digikey.ca/en/products/detail/panasonic-electronic-components/ERJ-3GEYJ304V/135883; Package: 0603; SupplierPartNumber: P300KGTR-ND; SuppliersPartNumber: C403476; PartNumber: ERJ3GEYJ304V
R520 R521 = ERA3AEB4021V: Res 4.02KOhm 1/10W 0603; Manufacturer_Name: Panasonic; PartNumber: ERJ3GEYJ200V; Link: https://www.digikey.ca/en/products/detail/panasonic-electronic-components/ERA-3AEB4021V/2026802?s=N4IgTCBcDaIKICUCCBmJcBCAWADGAjAGogC6AvkA; Package: 0603; SupplierPartNumber: P4.02KDBTR-ND; SuppliersPartNumber: C491130
U500 = ADS7828E/2K5: ADC 12bit 8Ch; Manufacturer: Texas Instruments; PartNumber: ADS7828E/2K5; SupplierNumber: 2156-ADS7828E/2K5-ND; Value: *; Link: https://www.digikey.ca/en/products/detail/texas-instruments/ADS7828E-2K5/1689481; Package: TSSOP-16
U501 = LM2902KAVQPWR: OpAmps 4Channel; Manufacturer: Texas Instruments; Link: https://www.digikey.ca/en/products/detail/texas-instruments/LM2902KAVQPWR/857694; PartNumber: LM2902KAVQPWR; SupplierNumber: 296-28750-2-ND; SuppliersPartNumber: C496124; Package: TSSOP-14; Value: *

## Sheet 6_Auxilaries.SchDoc
size A4
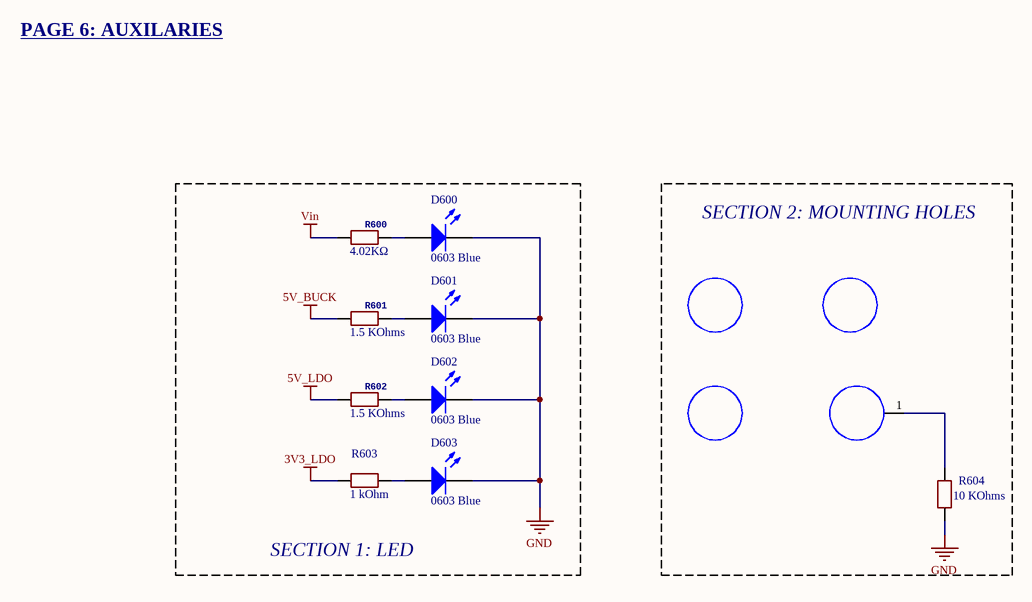
[diagram p5: 6_Auxilaries.SchDoc]

### Parts
D600  0603 Blue  [0603_LED_S1]
D601  0603 Blue  [0603_LED_S1]
D602  0603 Blue  [0603_LED_S1]
D603  0603 Blue  [0603_LED_S1]
H600  M3 not plated  [M3 not plated]  (value not drawn)
H601  M3 not plated  [M3 not plated]  (value not drawn)
H602  M3 plated  [M3 plated]  (value not drawn)
H603  M3 not plated  [M3 not plated]  (value not drawn)
R600  value 4.02KΩ  [RES_0603]  (hidden comment: ERA3AEB4021V)
R601  value 1.5 KOhms  [RES_0603]  (hidden comment: ERJ3EKF1501V)
R602  value 1.5 KOhms  [RES_0603]  (hidden comment: ERJ3EKF1501V)
R603  value 1 kOhm  [RES_0603]  (hidden comment: ERJ3GEYJ102V)
R604  value 10 KOhms  [RES_0603]  (hidden comment: ERJ3GEYJ103V)

### Blocks framed on the sheet
SECTION 1: LED: D600-D603 R600-R603
SECTION 2: MOUNTING HOLES: H600-H603 R604

### Nets
3V3_LDO: R603.1
5V_BUCK: R601.1
5V_LDO: R602.1
GND: D600.K D601.K D602.K D603.K R604.2
Vin: R600.1
NetD600_A: D600.A R600.2
NetD601_A: D601.A R601.2
NetD602_A: D602.A R602.2
NetD603_A: D603.A R603.2
NetH602_1: H602.1 R604.1

### Notes on the sheet
- PAGE 6: AUXILARIES

### Library data of the parts
D600-D603 = 0603 LED Blue: LED; ComponentLink1Description: 供应商链接; ComponentLink1URL: http://www.szlcsc.com/product/details_73150.html; Package: 0603; Supplier: LC; SuppliersPartNumber: C72041; Color: Blue
H600 H601 H603 = M3 not plated: M3 hole not plated
H602 = M3 plated: M3 hole plated
R600 = ERA3AEB4021V: as R520 on sheet 5_AnalogSense; Link: https://www.digikey.ca/en/products/detail/panasonic-electronic-components/ERA-3AEB4021V/2026802?s=N4IgTCBcDaIKICUCCBmJcBCAWADGAjAGogC6AvkA; Package: 0603; SupplierPartNumber: P4.02KDBTR-ND; SuppliersPartNumber: C491130
R601 R602 = ERJ3EKF1501V: Res 1.5KOhms 1/10W 0603; Link: https://www.digikey.ca/en/products/detail/panasonic-electronic-components/ERJ-3EKF1501V/196052?s=N4IgTCBcDaIKICUBSBmOBpAYgRgKwAZsA1EAXQF8g; Package: 0603; PartNumber: ERJ3EKF1501V; SupplierPartNumber: P1.50KHTR-ND; SuppliersPartNumber: C193392
R603 = ERJ3GEYJ102V: as R506 on sheet 5_AnalogSense; SymbolName_1: ERJ3GEYJ102V; Link: https://www.digikey.ca/en/products/detail/panasonic-electronic-components/ERJ-3GEYJ102V/68472?s=N4IgTCBcDaIKICUBSBmA4nAmkgjABjADUQBdAXyA; Package: 0603; PartNumber: ERJ3GEYJ102V; SupplierPartNumber: P1.0KGCT-ND; SuppliersPartNumber: C180848
R604 = ERJ3GEYJ103V: Res 10KOhms 1/10W 0603; Link: https://www.mouser.ca/ProductDetail/Panasonic/ERJ-3GEYJ103V?qs=66DK8nO8gJBWgc%252B0VNNxzg%3D%3D; Package: 0603; PartNumber: ERJ3GEYJ103V; SupplierPartNumber: 667-ERJ-3GEYJ103V; SuppliersPartNumber: C169849

## Sheet 7_Peripherals.SchDoc
size A4
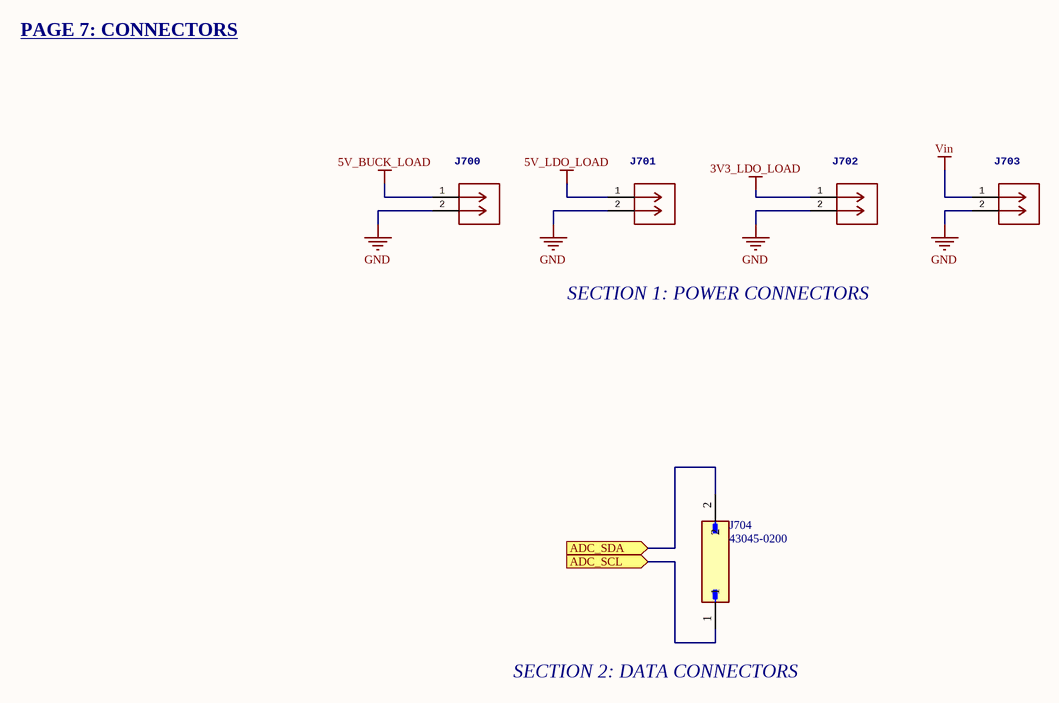
[diagram p6: 7_Peripherals.SchDoc]

### Parts
J700  05325-90229  [MOLEX_532590229]  (value not drawn)
J701  05325-90229  [MOLEX_532590229]  (value not drawn)
J702  05325-90229  [MOLEX_532590229]  (value not drawn)
J703  05325-90229  [MOLEX_532590229]  (value not drawn)
J704  43045-0200  [MOLEX_43045-0200]

### Ports
ADC_SCL (in), ADC_SDA (in)

### Nets
3V3_LDO_LOAD: J702.1
5V_BUCK_LOAD: J700.1
5V_LDO_LOAD: J701.1
GND: J700.2 J701.2 J702.2 J703.2
Vin: J703.1
ADC_SCL: J704.1 ; port ADC_SCL
ADC_SDA: J704.2 ; port ADC_SDA

### Notes on the sheet
- PAGE 7: CONNECTORS
- SECTION 1: POWER CONNECTORS
- SECTION 2: DATA CONNECTORS

### Library data of the parts
J700-J703 = 0532590229: Molex Mighty-SPOX 2POS; DeviceSetName: 532590229; Manufacturer: Molex; PartNumber: 532590229; SupplierNumber: WM14648-ND; SuppliersPartNumber: *; Link: https://www.digikey.ca/en/products/detail/molex/0532590229/3263134?s=N4IgTCBcDaIKwGYxwJwAYxhSAugXyA
J704 = 43045-0200: Molex Microfit 2POS; SupplerNumber: WM1813-ND; MF: Molex; Digi-Key_Part_Number: WM1813-ND; SnapEDA_Link: https://www.snapeda.com/parts/43045-0200/Molex/view-part/?ref=snap; Purchase-URL: https://pricing.snapeda.com/search/part/43045-0200/?ref=eda; Package: None; MP: 43045-0200; Check_prices: https://www.snapeda.com/parts/43045-0200/Molex/view-part/?ref=eda; Value: *; PartNumber: 43045-0200; Link: https://www.digikey.ca/en/products/detail/molex/0430450200/252526?s=N4IgTCBcDaICwGYAMcCsBaJYlJAXQF8g

## Nets that join several sheets
3V3_LDO: 3_3V3LDO (6 pins), 5_AnalogSense (8 pins), 6_Auxilaries (R603.1)
3V3_LDO_LOAD: 5_AnalogSense (R510.1 R513.2), 7_Peripherals (J702.1)
5V_BUCK: 2_5VSwithcingRegulator (7 pins), 3_3V3LDO (C302.1 R301.2 U300.8), 4_5VLDO (C402.1 R401.2 U400.8), 5_AnalogSense (R500.1 R502.1), 6_Auxilaries (R601.1)
5V_BUCK_LOAD: 5_AnalogSense (R500.2 R501.1), 7_Peripherals (J700.1)
5V_LDO: 4_5VLDO (6 pins), 5_AnalogSense (R505.1 R507.1), 6_Auxilaries (R602.1)
5V_LDO_LOAD: 5_AnalogSense (R505.2 R506.1), 7_Peripherals (J701.1)
GND: 1_InputPowerProtection (D100.2 D101.2 R101.1 U100.4), 2_5VSwithcingRegulator (12 pins), 3_3V3LDO (8 pins), 4_5VLDO (8 pins), 5_AnalogSense (19 pins), 6_Auxilaries (5 pins), 7_Peripherals (J700.2 J701.2 J702.2 J703.2)
Vin: 1_InputPowerProtection (5 pins), 6_Auxilaries (R600.1), 7_Peripherals (J703.1)
Vin_CLEAN: 1_InputPowerProtection (6 pins), 5_AnalogSense (R519.1 R521.1 U501.4)
Vin_CLEAN_SENSED: 2_5VSwithcingRegulator (C201.2 C202.2 R200.2 U200.7), 5_AnalogSense (R519.2 R520.1)
ADC_SCL: 5_AnalogSense (U500.14), 7_Peripherals (J704.1)
ADC_SDA: 5_AnalogSense (U500.15), 7_Peripherals (J704.2)